# Altium project ESP32-C3-RF-V1.0.PrjPcb (part 4 of 4)
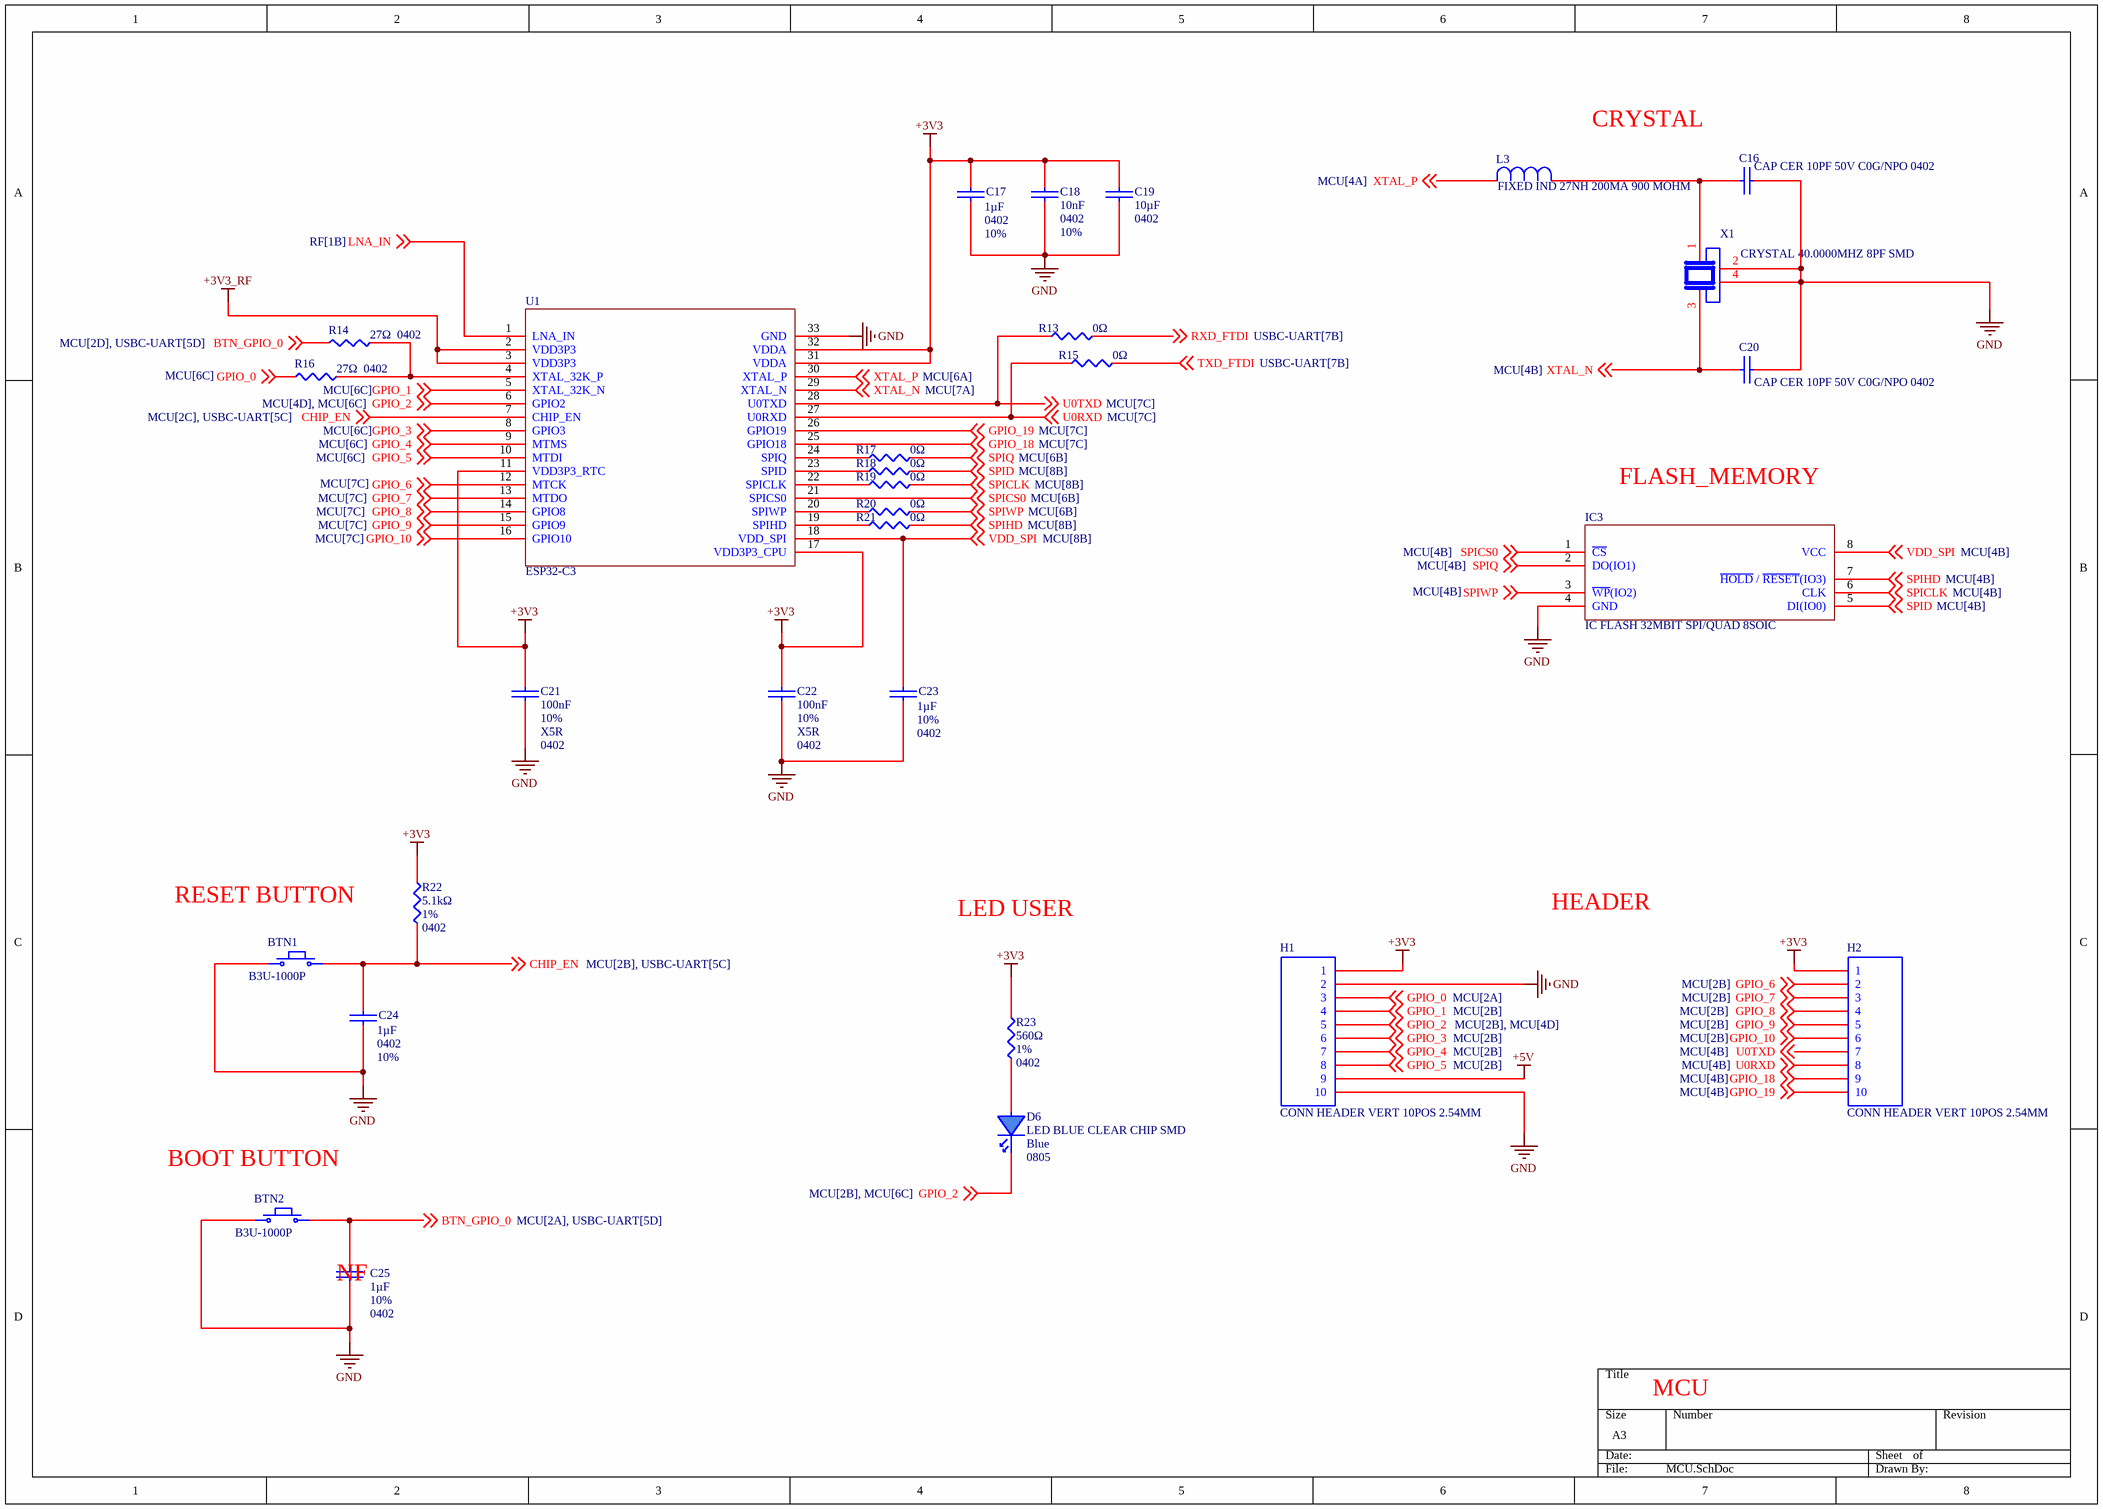
[diagram p7: MCU.SchDoc]

## Sheet MCU.SchDoc (continued)

### Library data of the parts (continued)
R22 = RC0402FR-075K1L: 62.5mW Thick Film Resistors 50V ±100ppm/℃ ±1% 5.1kΩ 0402 Chip Resistor - Surface Mount ROHS; Manufacturer: Yageo Group; Max Power Dissipation: 63mW; Temperature Coefficient: 100ppm/°C; Supplier: DigiKey; Supplier Part Number: 311-5.10KLRCT-ND; Manufacturer Part Number: RC0402FR-075K1L; RoHS: Compliant; Category: Chip SMD Resistors; Stock: 480465; Pricing: 1=0,1, 10=0,021, 25=0,0148, 50=0,0118, 100=0,0095, 250=0,00728, 500=0,006, 1000=0,00502, 5000=0,00348 (USD); Case Code (Imperial): 0402; China RoHS: Non-Compliant; Composition: Thick Film; Country of Origin: Mainland China, Taiwan; Depth: 500µm; Export Control Classification Number (ECCN) Code: EAR99; Features: Moisture Resistant; Height: 350µm; Harmonized Tariff Schedule (HTS) Code: 8533.21.00.30; Introduction Date: 2008-07-18; Lead Free: Lead Free; Length: 1mm; Lifecycle Status: Production; Max Operating Temperature: 155°C; Military Standard: Not; Min Operating Temperature: -55°C; Mounting Technology: Surface Mount; Pins: 2; Number of Terminals: 2; Number of Terminations: 2; Packaging: Cut Tape; Power Dissipation: 62.5mW; Power Rating: 63mW; REACH SVHC: Yes; Schedule B: 8533210045, 8533210045|8533210045, 8533210045|8533210045|8533210045, 8533210045|8533210045|8533210045|8533210045; Termination: SMD/SMT; Voltage Rating: 50V; Voltage Rating (DC): 50V; Width: 500µm; Working Voltage: 50V; ComponentLink1URL: https://datasheet.octopart.com:443/RC0402FR-075K1L-Yageo-datasheet-175887523.pdf?src-supplier=IHS; ComponentLink1Description: https://datasheet.octopart.com:443/RC0402FR-075K1L-Yageo-datasheet-175887523.pdf?src-supplier=IHS; ComponentLink2URL: https://datasheet.octopart.com:443/RC0402FR-075K1L-Yageo-datasheet-103092701.pdf?src-supplier=Upverter; ComponentLink2Description: https://datasheet.octopart.com:443/RC0402FR-075K1L-Yageo-datasheet-103092701.pdf?src-supplier=Upverter; ComponentLink3URL: https://datasheet.octopart.com:443/RC0402FR-075K1L-Yageo-Group-datasheet-190305687.pdf?src-supplier=Future+Electronics; ComponentLink3Description: https://datasheet.octopart.com:443/RC0402FR-075K1L-Yageo-Group-datasheet-190305687.pdf?src-supplier=Future+Electronics; ComponentLink4URL: https://datasheet.octopart.com:443/RC0402FR-075K1L-Yageo-datasheet-164759695.pdf?src-supplier=Future+Electronics; ComponentLink4Description: https://datasheet.octopart.com:443/RC0402FR-075K1L-Yageo-datasheet-164759695.pdf?src-supplier=Future+Electronics; ComponentLink5URL: https://datasheet.octopart.com:443/RC0402FR-075K1L-Yageo-datasheet-137700087.pdf?src-supplier=Future+Electronics; ComponentLink5Description: https://datasheet.octopart.com:443/RC0402FR-075K1L-Yageo-datasheet-137700087.pdf?src-supplier=Future+Electronics; ComponentLink6URL: https://datasheet.octopart.com:443/RC0402FR-075K1L-Yageo-datasheet-12531192.pdf?src-supplier=Future+Electronics; ComponentLink6Description: https://datasheet.octopart.com:443/RC0402FR-075K1L-Yageo-datasheet-12531192.pdf?src-supplier=Future+Electronics; ComponentLink7URL: https://datasheet.octopart.com:443/RC0402FR-075K1L-Yageo-datasheet-505231.pdf?src-supplier=Future+Electronics; ComponentLink7Description: https://datasheet.octopart.com:443/RC0402FR-075K1L-Yageo-datasheet-505231.pdf?src-supplier=Future+Electronics; ComponentLink8URL: https://datasheet.octopart.com:443/RC0402FR-075K1L-Yageo-datasheet-10408619.pdf?src-supplier=Newark; ComponentLink8Description: https://datasheet.octopart.com:443/RC0402FR-075K1L-Yageo-datasheet-10408619.pdf?src-supplier=Newark; ComponentLink9URL: https://datasheet.octopart.com:443/RC0402FR-075K1L-Yageo-datasheet-8324527.pdf?src-supplier=Newark; ComponentLink9Description: https://datasheet.octopart.com:443/RC0402FR-075K1L-Yageo-datasheet-8324527.pdf?src-supplier=Newark; ComponentLink10URL: https://datasheet.octopart.com:443/RC0402FR-075K1L-Yageo-datasheet-62067350.pdf?src-supplier=element14+APAC; ComponentLink10Description: https://datasheet.octopart.com:443/RC0402FR-075K1L-Yageo-datasheet-62067350.pdf?src-supplier=element14+APAC; ComponentLink11URL: https://datasheet.octopart.com:443/RC0402FR-075K1L-Yageo-datasheet-148775077.pdf?src-supplier=TME; ComponentLink11Description: https://datasheet.octopart.com:443/RC0402FR-075K1L-Yageo-datasheet-148775077.pdf?src-supplier=TME; ComponentLink12URL: https://datasheet.octopart.com/RC0402FR-075K1L-Yageo-datasheet-73766026.pdf; ComponentLink12Description: https://datasheet.octopart.com/RC0402FR-075K1L-Yageo-datasheet-73766026.pdf; ComponentLink13URL: https://datasheet.octopart.com:443/RC0402FR-075K1L-Yageo-datasheet-8329306.pdf?src-supplier=element14; ComponentLink13Description: https://datasheet.octopart.com:443/RC0402FR-075K1L-Yageo-datasheet-8329306.pdf?src-supplier=element14; ComponentLink14URL: http://sigma.octopart.com:80/conflict_mineral_statement/Yageo-company-3.pdf?src-supplier=Compliance+Statements; ComponentLink14Description: http://sigma.octopart.com:80/conflict_mineral_statement/Yageo-company-3.pdf?src-supplier=Compliance+Statements; ComponentLink15URL: http://sigma.octopart.com:80/rohs_statement/Yageo-company-2.pdf?src-supplier=Compliance+Statements; ComponentLink15Description: http://sigma.octopart.com:80/rohs_statement/Yageo-company-2.pdf?src-supplier=Compliance+Statements; LCSC Part: C105872
R23 = RC0402FR-13560RL: RC Series 0402 0.063 W 560 Ohm ±1% ±100 ppm/°C SMT Thick Film Chip Resistor; Manufacturer: Yageo Group; Power Dissipation: 62.5mW; Voltage Rating: 50V; Supplier: DigiKey; Supplier Part Number: 13-RC0402FR-13560RLCT-ND; Manufacturer Part Number: RC0402FR-13560RL; RoHS: Compliant; Category: Chip SMD Resistors; Stock: 92469; Pricing: 1=0,1, 10=0,021, 25=0,0148, 50=0,0118, 100=0,0095, 250=0,00728, 500=0,006, 1000=0,00502, 5000=0,00348 (USD); Case Code (Imperial): 0402; Case Code (Metric): 1005; China RoHS: Non-Compliant; Composition: Thick Film; Contact Plating: Tin; Height: 350µm; Lead Free: Lead Free; Length: 1mm; Lifecycle Status: Production; Max Operating Temperature: 155°C; Min Operating Temperature: -55°C; Mounting Technology: Surface Mount; Number of Terminals: 2; Packaging: Tape & Reel; Power Rating: 62.5mW; Radiation Hardening: No; REACH SVHC: Yes; Temperature Coefficient: 100ppm/°C; Termination: SMD/SMT; Width: 500µm; Working Voltage: 50V; ComponentLink1URL: https://datasheet.octopart.com:443/RC0402FR-13560RL-Yageo-datasheet-175887523.pdf?src-supplier=IHS; ComponentLink1Description: https://datasheet.octopart.com:443/RC0402FR-13560RL-Yageo-datasheet-175887523.pdf?src-supplier=IHS; ComponentLink2URL: https://datasheet.octopart.com:443/RC0402FR-13560RL-Yageo-datasheet-10408619.pdf?src-supplier=Future+Electronics; ComponentLink2Description: https://datasheet.octopart.com:443/RC0402FR-13560RL-Yageo-datasheet-10408619.pdf?src-supplier=Future+Electronics; ComponentLink3URL: https://datasheet.octopart.com:443/RC0402FR-13560RL-Yageo-Group-datasheet-176638170.pdf?src-supplier=Future+Electronics; ComponentLink3Description: https://datasheet.octopart.com:443/RC0402FR-13560RL-Yageo-Group-datasheet-176638170.pdf?src-supplier=Future+Electronics; ComponentLink4URL: https://datasheet.octopart.com:443/RC0402FR-13560RL-Yageo-datasheet-164759695.pdf?src-supplier=Future+Electronics; ComponentLink4Description: https://datasheet.octopart.com:443/RC0402FR-13560RL-Yageo-datasheet-164759695.pdf?src-supplier=Future+Electronics; ComponentLink5URL: https://datasheet.octopart.com:443/RC0402FR-13560RL-Yageo-datasheet-137700087.pdf?src-supplier=Future+Electronics; ComponentLink5Description: https://datasheet.octopart.com:443/RC0402FR-13560RL-Yageo-datasheet-137700087.pdf?src-supplier=Future+Electronics; ComponentLink6URL: https://datasheet.octopart.com:443/RC0402FR-13560RL-Yageo-datasheet-12531192.pdf?src-supplier=Future+Electronics; ComponentLink6Description: https://datasheet.octopart.com:443/RC0402FR-13560RL-Yageo-datasheet-12531192.pdf?src-supplier=Future+Electronics; ComponentLink7URL: https://datasheet.octopart.com/RC0402FR-13560RL-Yageo-datasheet-73766026.pdf; ComponentLink7Description: https://datasheet.octopart.com/RC0402FR-13560RL-Yageo-datasheet-73766026.pdf; ComponentLink8URL: http://sigma.octopart.com:80/conflict_mineral_statement/Yageo-company-3.pdf?src-supplier=Compliance+Statements; ComponentLink8Description: http://sigma.octopart.com:80/conflict_mineral_statement/Yageo-company-3.pdf?src-supplier=Compliance+Statements; ComponentLink9URL: http://sigma.octopart.com:80/rohs_statement/Yageo-company-2.pdf?src-supplier=Compliance+Statements; ComponentLink9Description: http://sigma.octopart.com:80/rohs_statement/Yageo-company-2.pdf?src-supplier=Compliance+Statements; LCSC Part: C4098662
U1 = ESP32-C3: 400KB 22 3V~3.6V RISC-V 160MHz QFN-32-EP(5x5) Microcontroller Units (MCUs/MPUs/SOCs) ROHS; Manufacturer: Espressif Systems; Max Supply Voltage: 3.6V; Min Supply Voltage: 3V; Operating Supply Voltage: 3.3V; Supplier: DigiKey; Supplier Part Number: 1904-ESP32-C3CT-ND; Manufacturer Part Number: ESP32-C3; Category: System on Chip (SoC); Stock: 1453; Pricing: 1=1,07 (USD); Height - Seated (Max): 900µm; Length: 5mm; Max Operating Temperature: 105°C; Min Operating Temperature: -40°C; Number of Terminals: 32; Terminal Pitch: 500µm; Width: 5mm; ComponentLink1URL: https://datasheet.octopart.com:443/ESP32-C3-Espressif-Systems-datasheet-156944166.pdf?src-supplier=IHS; ComponentLink1Description: https://datasheet.octopart.com:443/ESP32-C3-Espressif-Systems-datasheet-156944166.pdf?src-supplier=IHS; ComponentLink2URL: https://datasheet.octopart.com:443/ESP32-C3-Espressif-Systems-datasheet-188867343.pdf?src-supplier=TME; ComponentLink2Description: https://datasheet.octopart.com:443/ESP32-C3-Espressif-Systems-datasheet-188867343.pdf?src-supplier=TME; ComponentLink3URL: https://datasheet.octopart.com:443/ESP32-C3-Espressif-Systems-datasheet-165560559.pdf?src-supplier=TME; ComponentLink3Description: https://datasheet.octopart.com:443/ESP32-C3-Espressif-Systems-datasheet-165560559.pdf?src-supplier=TME; LCSC Part: C2838500
X1 = XRCGB40M000F1S1BR0: Crystal 40MHz ±10ppm (Tol) ±10ppm (Stability) 8pF 50Ohm 4-Pin CSMD T/R; Manufacturer: Murata; ESR (Equivalent Series Resistance): 50Ω; Frequency Tolerance: 0.001%; Supplier: DigiKey; Supplier Part Number: 490-XRCGB40M000F1S1BR0CT-ND; Manufacturer Part Number: XRCGB40M000F1S1BR0; RoHS: Compliant; Category: Crystals; Stock: 1134; Pricing: 1=0,32, 10=0,275, 25=0,2596, 50=0,2488, 100=0,2386, 250=0,22564, 500=0,21632, 1000=0,20736 (USD); Export Control Classification Number (ECCN) Code: EAR99; Frequency: 40MHz; Frequency Stability: 10ppm; Height: 700µm; Harmonized Tariff Schedule (HTS) Code: 8541.60.00.60; Introduction Date: 2022-06-14; Lifecycle Status: Production; Load Capacitance: 8pF; Max Operating Temperature: 85°C; Min Operating Temperature: -30°C; Mounting Technology: Surface Mount; REACH SVHC: Yes; Schedule B: 8541600080, 8541600080|8541600080, 8541600080|8541600080|8541600080, 8541600080|8541600080|8541600080|8541600080; ESR: 50Ω; Tolerance: 0.001%; ComponentLink1URL: https://datasheet.octopart.com:443/XRCGB40M000F1S1BR0-Murata-datasheet-180814757.pdf?src-supplier=IHS; ComponentLink1Description: https://datasheet.octopart.com:443/XRCGB40M000F1S1BR0-Murata-datasheet-180814757.pdf?src-supplier=IHS; ComponentLink2URL: https://datasheet.octopart.com:443/XRCGB40M000F1S1BR0-Murata-datasheet-141295020.pdf?src-supplier=Ciiva; ComponentLink2Description: https://datasheet.octopart.com:443/XRCGB40M000F1S1BR0-Murata-datasheet-141295020.pdf?src-supplier=Ciiva; ComponentLink3URL: http://sigma.octopart.com:80/reach_statement/Murata-company-16.pdf?src-supplier=Compliance+Statements; ComponentLink3Description: http://sigma.octopart.com:80/reach_statement/Murata-company-16.pdf?src-supplier=Compliance+Statements; LCSC Part: C1870451

## Nets that join several sheets
+3V3: USBC-UART (R2.2), POWER_SUPPLY (C9.2 C10.2 IC2.3 R12.2), RF (C12.2 C13.2 L1.2), MCU (13 pins)
+3V3_RF: RF (C11.2 L1.1), MCU (U1.2 U1.3)
+5V: USBC-UART (5 pins), POWER_SUPPLY (C7.2 C8.2 IC2.1), MCU (H1.9)
GND: USBC-UART (22 pins), POWER_SUPPLY (7 pins), RF (6 pins), MCU (18 pins)
BTN_GPIO_0: USBC-UART (Q2.2), MCU (BTN2.2 C25.2 R14.1)
CHIP_EN: USBC-UART (Q1.3), MCU (BTN1.2 C24.2 R22.1 U1.7)
LNA_IN: RF (C14.2 L2.2), MCU (U1.1)
RXD_FTDI: USBC-UART (IC1.1), MCU (R13.2)
TXD_FTDI: USBC-UART (IC1.17), MCU (R15.2)

## Assembly variants
Variant of ESP32-C3-RF-V1.0: not fitted C25 R2 R7